# Altium schematic sheet USB_Board.SchDoc
size A4
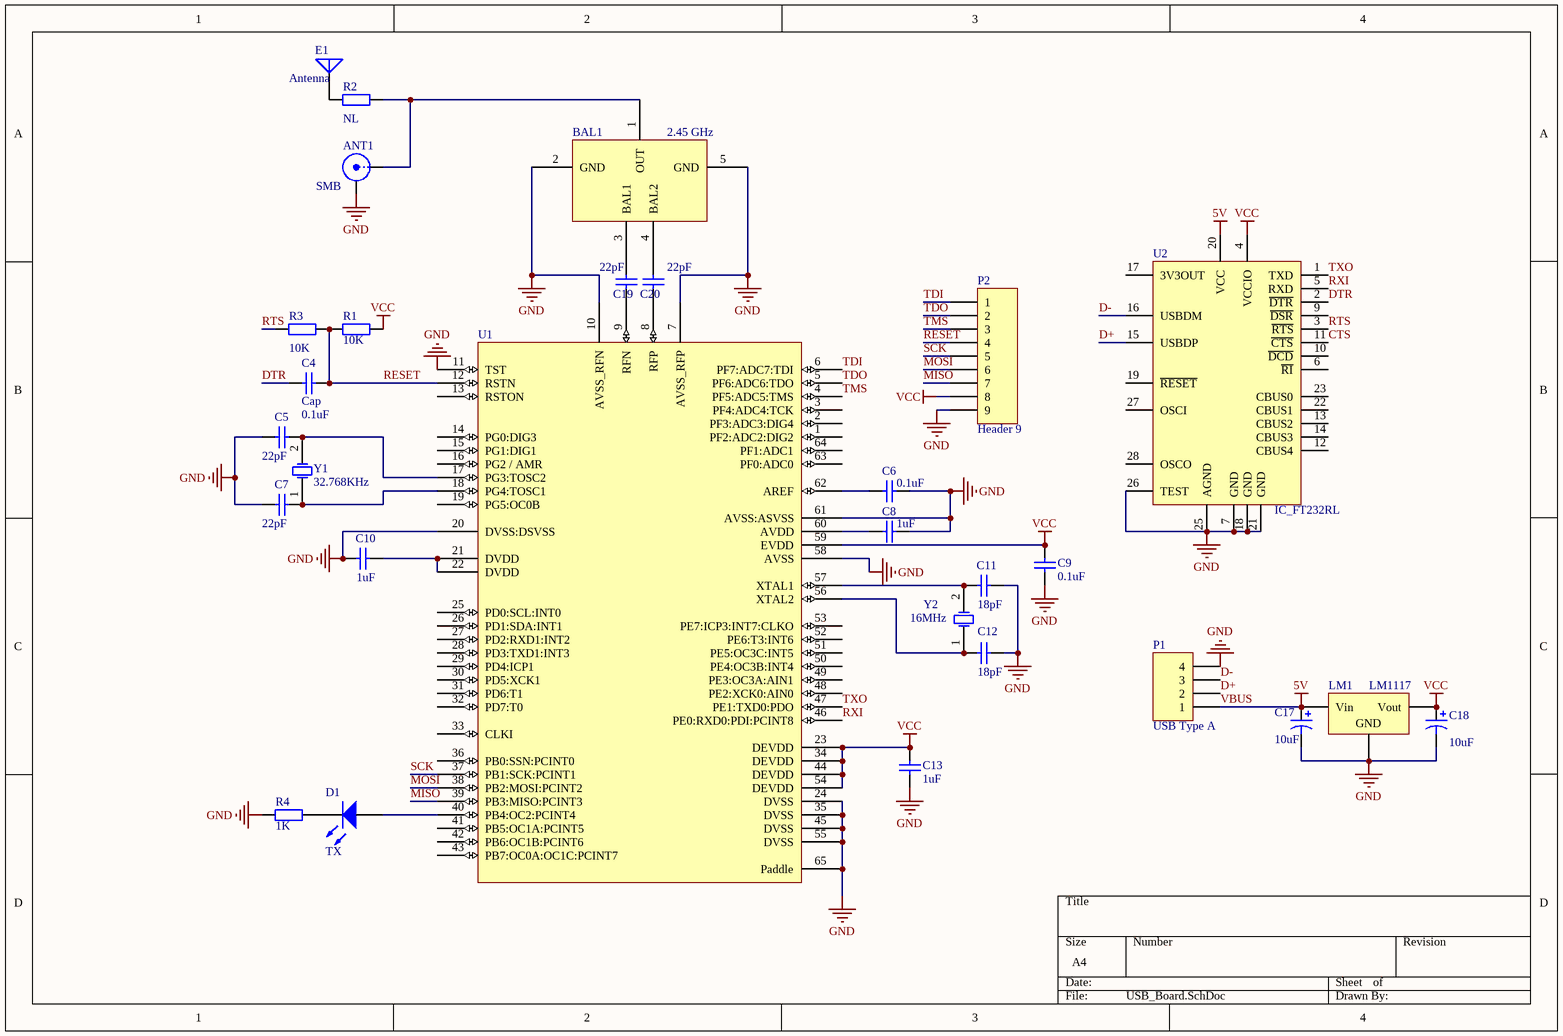
[diagram p0: USB_Board.SchDoc]

## Parts
ANT1  SMB  [SMB_V-RJ45]
BAL1  2.45 GHz
C4  Cap  value 0.1uF  [1608[0603]]
C5  value 22pF  [1608[0603]]  (hidden comment: Cap)
C6  value 0.1uF  [1608[0603]]  (hidden comment: Cap)
C7  value 22pF  [1608[0603]]  (hidden comment: Cap)
C8  value 1uF  [1608[0603]]  (hidden comment: Cap)
C9  value 0.1uF  [1608[0603]]  (hidden comment: Cap)
C10  value 1uF  [1608[0603]]  (hidden comment: Cap)
C11  value 18pF  [1608[0603]]  (hidden comment: Cap)
C12  value 18pF  [1608[0603]]  (hidden comment: Cap)
C13  value 1uF  [1608[0603]]  (hidden comment: Cap)
C17  value 10uF  [3015[1206]]  (hidden comment: Cap Pol1)
C18  value 10uF  [3015[1206]]  (hidden comment: Cap Pol1)
C19  value 22pF  [1608[0603]]  (hidden comment: Cap)
C20  value 22pF  [1608[0603]]  (hidden comment: Cap)
D1  TX  [1608[0603]]
E1  Antenna  [Antennas 2.4G SMD MOLEX]
LM1  LM1117  [LM1117]
P1  USB Type A  [USB/SM2.5-4H4A]
P2  Header 9  [HDR1X9]
R1  value 10K  [1608[0603]]  (hidden comment: Res2)
R2  value NL  [1608[0603]]  (hidden comment: Res2)
R3  value 10K  [1608[0603]]  (hidden comment: Res2)
R4  value 1K  [1608[0603]]  (hidden comment: Res2)
U1  ATmega128RFA1-DE  [MLF64-M2]  (value not drawn)
U2  IC_FT232RL  [SSOP-28]
Y1  32.768KHz  [Crystal]
Y2  16MHz  [BCY-W2/E4.7]

## Nets
GND: ANT1.2(Y) BAL1.2(GND) BAL1.5(GND) C5.2 C6.2 C7.2 C8.2 C9.2 C10.1 C11.1 C12.1 C13.2 C17.2 C18.2 LM1.2(GND) P1.4 P2.9 R4.2 U1.7(AVSS_RFP) U1.10(AVSS_RFN) U1.11(TST) U1.20(DVSS:DSVSS) U1.24(DVSS) U1.35(DVSS) U1.45(DVSS) U1.55(DVSS) U1.58(AVSS) U1.61(AVSS:ASVSS) U1.65(Paddle) U2.7(GND) U2.18(GND) U2.21(GND) U2.25(AGND) U2.26(TEST)
NC: U2.8(NC) U2.24(NC)
VBUS: C17.1 LM1.1(Vin) P1.1 U2.20(VCC)  [also labelled 5V]
VCC: C9.1 C13.1 C18.1 LM1.3(Vout) P2.8 R1.2 U1.23(DEVDD) U1.34(DEVDD) U1.44(DEVDD) U1.54(DEVDD) U1.59(EVDD) U2.4(VCCIO)
CTS: U2.11(~{CTS})
D+: P1.2 U2.15(USBDP)
D-: P1.3 U2.16(USBDM)
DTR: C4.1 U2.2(~{DTR})
MISO: P2.7 U1.39(PB3:MISO:PCINT3)
MOSI: P2.6 U1.38(PB2:MOSI:PCINT2)
RESET: C4.2 P2.4 R1.1 R3.1 U1.12(RSTN)
RTS: R3.2 U2.3(~{RTS})
RXI: U1.46(PE0:RXD0:PDI:PCINT8) U2.5(RXD)
SCK: P2.5 U1.37(PB1:SCK:PCINT1)
TDI: P2.1 U1.6(PF7:ADC7:TDI)
TDO: P2.2 U1.5(PF6:ADC6:TDO)
TMS: P2.3 U1.4(PF5:ADC5:TMS)
TXO: U1.47(PE1:TXD0:PDO) U2.1(TXD)
NetANT1_1: ANT1.1(X) BAL1.1(OUT) R2.2
NetBAL1_3: BAL1.3(BAL1) C19.2
NetBAL1_4: BAL1.4(BAL2) C20.2
NetC5_1: C5.1 U1.17(PG3:TOSC2) Y1.2(OSC2)
NetC6_1: C6.1 U1.62(AREF)
NetC7_1: C7.1 U1.18(PG4:TOSC1) Y1.1(OSC1)
NetC8_1: C8.1 U1.60(AVDD)
NetC10_2: C10.2 U1.21(DVDD) U1.22(DVDD)
NetC11_2: C11.2 U1.57(XTAL1) Y2.2(OSC2)
NetC12_2: C12.2 U1.56(XTAL2) Y2.1(OSC1)
NetC19_1: C19.1 U1.9(RFN)
NetC20_1: C20.1 U1.8(RFP)
NetD1_1: D1.1 U1.40(PB4:OC2:PCINT4)
NetD1_2: D1.2 R4.1
NetE1_1: E1.1(A) R2.1

Not connected (* = marked no-connect by the designer): U1 1(PF2:ADC2:DIG2) 2(PF3:ADC3:DIG4) 3(PF4:ADC4:TCK) 13(RSTON) 14(PG0:DIG3) 15(PG1:DIG1) 16(PG2_/_AMR) 19(PG5:OC0B) 25(PD0:SCL:INT0) 26(PD1:SDA:INT1) 27(PD2:RXD1:INT2) 28(PD3:TXD1:INT3) 29(PD4:ICP1) 30(PD5:XCK1) 31(PD6:T1) 32(PD7:T0) 33(CLKI) 36(PB0:SSN:PCINT0) 41(PB5:OC1A:PCINT5) 42(PB6:OC1B:PCINT6) 43(PB7:OC0A:OC1C:PCINT7) 48(PE2:XCK0:AIN0) 49(PE3:OC3A:AIN1) 50(PE4:OC3B:INT4) 51(PE5:OC3C:INT5) 52(PE6:T3:INT6) 53(PE7:ICP3:INT7:CLKO) 63(PF0:ADC0) 64(PF1:ADC1); U2 6(~{RI}) 9(~{DSR}) 10(~{DCD}) 12(CBUS4) 13(CBUS2) 14(CBUS3) 17(3V3OUT) 19(~{RESET}) 22(CBUS1) 23(CBUS0) 27(OSCI) 28(OSCO)

## Library data of the parts
ANT1 = SMB: SMB Straight Connector; LatestRevisionDate: 17-Jul-2002; LatestRevisionNote: Re-released for DXP Platform.; Publisher: Altium Limited
BAL1 = BALUN
C4-C13 C19 C20 = Cap: Capacitor; Published: 8-Jun-2000; LatestRevisionDate: 17-Jul-2002; LatestRevisionNote: Re-released for DXP Platform.; PackageReference: RAD-0.3; Publisher: Altium Limited
C17 C18 = Cap Pol1: Polarized Capacitor (Radial); Published: 8-Jun-2000; LatestRevisionDate: 17-Jul-2002; LatestRevisionNote: Re-released for DXP Platform.; PackageReference: RB7.6-15; Publisher: Altium Limited
D1 = LED SMD (0603)
E1 = Antenna: Generic Antenna; Published: 24-Mar-1999; LatestRevisionDate: 17-Jul-2002; LatestRevisionNote: Re-released for DXP Platform.; PackageReference: PIN1; Publisher: Altium Limited
LM1 = Volt Reg: Voltage Regulator; pin to pad: 1>3 2>1 3>2; Published: 24-Mar-1999; LatestRevisionDate: 29-May-2009; LatestRevisionNote: IPC-7351 Footprint Added.; PackageReference: D2PAK; Publisher: Altium Limited; PackageDescription: 3-Pin Transistor Outline Package 2.54 mm Pitch, 15.1 mm Lead Span
P1 = Header 4: Header, 4-Pin; LatestRevisionDate: 17-Jul-2002; LatestRevisionNote: Re-released for DXP Platform.; Publisher: Altium Limited
P2 = Header 9: Header, 9-Pin; LatestRevisionDate: 17-Jul-2002; LatestRevisionNote: Re-released for DXP Platform.; Publisher: Altium Limited
R1-R4 = Res2: Resistor; Published: 8-Jun-2000; LatestRevisionDate: 17-Jul-2002; LatestRevisionNote: Re-released for DXP Platform.; PackageReference: AXIAL-0.4; Publisher: Altium Limited
U1 = ATmega128RFA1-DE: 802.15.4 compliant AVR transceiver; verified by: vlarsen; verified date: 2010-12-05; Status: Verified
U2 = IC_FT232RL: FT232R USB UART; Manufacturer: *; Note: *; ManufacturerPartNo: *
Y1 Y2 = XTAL: Crystal Oscillator; Published: 8-Jun-2000; LatestRevisionDate: 17-Jul-2002; LatestRevisionNote: Re-released for DXP Platform.; PackageReference: R38; Publisher: Altium Limited